# EAGLE schematic simple-loop-screws (EAGLE 6.6.0)

## Sheet 1 of 2
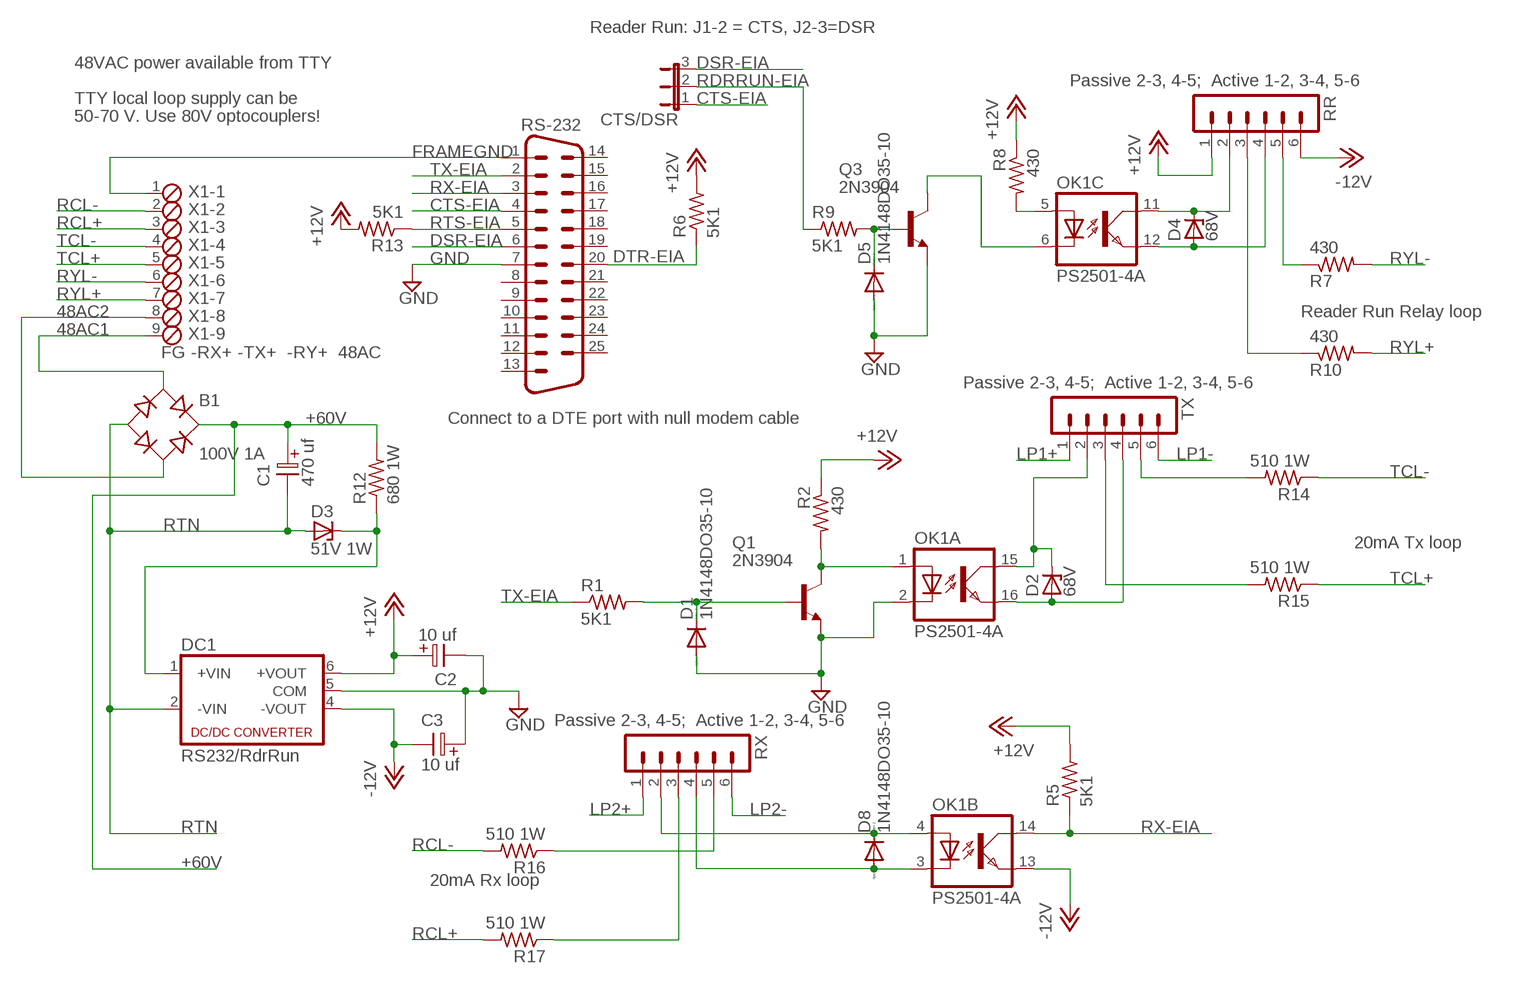
[diagram p0: schematic, sheet 1]

### Parts
B1  100V 1A  RB1A  [RB1A]
C1  470 uf  ELC-7,5  [ES-7,5]
C2  10 uf  ELC-2,5  [ES-2,5]
C3  10 uf  ELC-2,5  [ES-2,5]
CTS/DSR  JP2E  [JP2]
D1  1N4148DO35-10  [DO35-10]
D2  68V  ZENER-DIODEDO41Z10  [DO41Z10]
D3  51V 1W  ZENER-DIODEDO41Z10  [DO41Z10]
D4  68V  ZENER-DIODEDO41Z10  [DO41Z10]
D5  1N4148DO35-10  [DO35-10]
D8  1N4148DO35-10  [DO35-10]
DC1  RS232/RdrRun  NMA  [NMA]
OK1  PS2501-4A  ILQ1  [DIL16]
Q1  2N3904  [TO92]
Q3  2N3904  [TO92]
R1  5K1  R-US_0207/10  [0207/10]
R2  430  R-US_0207/10  [0207/10]
R5  5K1  R-US_0207/10  [0207/10]
R6  5K1  R-US_0207/10  [0207/10]
R7  430  R-US_0207/10  [0207/10]
R8  430  R-US_0207/10  [0207/10]
R9  5K1  R-US_0207/10  [0207/10]
R10  430  R-US_0207/10  [0207/10]
R12  680 1W  R-US_0817/7V  [P0817V]
R13  5K1  R-US_0207/10  [0207/10]
R14  510 1W  R-US_0817/7V  [P0817V]
R15  510 1W  R-US_0817/7V  [P0817V]
R16  510 1W  R-US_0817/7V  [P0817V]
R17  510 1W  R-US_0817/7V  [P0817V]
RR  MA06-1  [MA06-1]
RS-232  M25H  [M25H]
RX  MA06-1  [MA06-1]
TX  MA06-1  [MA06-1]
X1  FG -RX+ -TX+ -RY+ 48AC  MPT9  [9POL254]

### Nets
48AC1: B1.AC1 X1.9
48AC2: B1.AC2 X1.8
+12V: C2.1 DC1.6(+VOUT) R2.1 R5.2 R6.2 R8.1 R13.2 RR.1
+48VDC: D3.C DC1.1(+VIN) R12.1
+60V: B1.+ C1.1 R12.2 ; also sheet 2
-12V: C3.2 DC1.4(-VOUT) OK1.13(B:EMIT) RR.6
CTS-EIA: CTS/DSR.1 RS-232.4
DSR-EIA: CTS/DSR.3 RS-232.6
DTR-EIA: R6.1 RS-232.20
FRAMEGND: RS-232.1 X1.1
GND [GND]: C2.2 C3.1 D1.A D5.A DC1.5(COM) OK1.2(A:C) Q1.3(E) Q3.3(E) RS-232.7
LP1+: TX.1 ; also sheet 2
LP1-: TX.6 ; also sheet 2
LP2+: RX.1 ; also sheet 2
LP2-: RX.6 ; also sheet 2
N$1: D8.C OK1.4(B:A) RX.2
N$2: R16.1 RX.5
N$3: D8.A OK1.3(B:C) RX.4
N$4: D2.A OK1.16(A:EMIT) TX.4
N$5: OK1.5(C:A) R8.2
N$6: D2.C OK1.15(A:COL) TX.2
N$7: D1.C Q1.2(B) R1.2
N$8: D4.C OK1.11(C:COL) RR.2
N$9: OK1.1(A:A) Q1.1(C) R2.2
N$10: R10.1 RR.3
N$11: R7.1 RR.5
N$15: OK1.6(C:C) Q3.1(C)
N$16: D5.C Q3.2(B) R9.2
N$19: R14.2 TX.5
N$20: R17.1 RX.3
N$21: R15.2 TX.3
N$22: D4.A OK1.12(C:EMIT) RR.4
RCL+: R17.2 X1.3
RCL-: R16.2 X1.2
RDRRUN-EIA: CTS/DSR.2 R9.1
RTN: B1.- C1.2 D3.A DC1.2(-VIN) ; also sheet 2
RTS-EIA: R13.1 RS-232.5
RX-EIA: OK1.14(B:COL) R5.1 RS-232.3
RYL+: R10.2 X1.7
RYL-: R7.2 X1.6
TCL+: R15.1 X1.5
TCL-: R14.1 X1.4
TX-EIA: R1.1 RS-232.2
Unconnected: RS-232.8 RS-232.9 RS-232.10 RS-232.11 RS-232.12 RS-232.13 RS-232.14 RS-232.15 RS-232.16 RS-232.17 RS-232.18 RS-232.19 RS-232.21 RS-232.22 RS-232.23 RS-232.24 RS-232.25

### Notes on the sheet
- Reader Run: J1-2 = CTS, J2-3=DSR
- 48VAC power available from TTY
- Passive 2-3, 4-5;  Active 1-2, 3-4, 5-6
- TTY local loop supply can be
- 50-70 V. Use 80V optocouplers!
- Reader Run Relay loop
- Passive 2-3, 4-5;  Active 1-2, 3-4, 5-6
- Connect to a DTE port with null modem cable
- 20mA Tx loop
- Passive 2-3, 4-5;  Active 1-2, 3-4, 5-6
- 20mA Rx loop

## Sheet 2 of 2
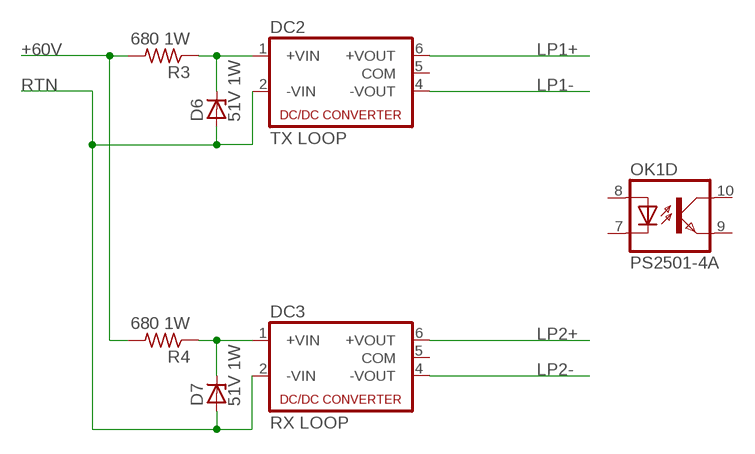
[diagram p1: schematic, sheet 2]

### Parts
D6  51V 1W  ZENER-DIODEDO41Z10  [DO41Z10]
D7  51V 1W  ZENER-DIODEDO41Z10  [DO41Z10]
DC2  TX LOOP  NMA  [NMA]
DC3  RX LOOP  NMA  [NMA]
R3  680 1W  R-US_0817/7V  [P0817V]
R4  680 1W  R-US_0817/7V  [P0817V]

### Nets
+48VDC1: D6.C DC2.1(+VIN) R3.1
+48VDC2: D7.C DC3.1(+VIN) R4.1
+60V: R3.2 R4.2 ; also sheet 1
LP1+: DC2.6(+VOUT) ; also sheet 1
LP1-: DC2.4(-VOUT) ; also sheet 1
LP2+: DC3.6(+VOUT) ; also sheet 1
LP2-: DC3.4(-VOUT) ; also sheet 1
RTN: D6.A D7.A DC2.2(-VIN) DC3.2(-VIN) ; also sheet 1
Unconnected: DC2.5(COM) DC3.5(COM) OK1.7(D:C) OK1.8(D:A) OK1.9(D:EMIT) OK1.10(D:COL)

## Library data of the parts
B1 = rectifier:RB1A: RECTIFIER 1 A
C1 = discrete:ELC-7,5
C2 C3 = discrete:ELC-2,5
CTS/DSR = jumper:JP2E: JUMPER
D1 D5 D8 = diode:1N4148: DIODE high speed (Philips)
D2-D4 D6 D7 = diode:ZENER-DIODE: Z-Diode
DC1-DC3 = dc-dc-converter:NMA: DC-DC CONVERTER; MF: C & D TECHNOLOGIES, INC; MPN: NMA0515SC; OC_FARNELL: 1021434; OC_NEWARK: 61K3064
OK1 = optocoupler:ILQ1: SIEMENS OPTO COUPLER; MF: VISHAY/TELEFUNKEN; MPN: ILQ1; OC_FARNELL: 1469501; OC_NEWARK: 88K1954
Q1 Q3 = transistor-npn:2N3904: NPN Transistor
R1-R10 R12-R17 = rcl:R-US_: RESISTOR, American symbol
RR RX TX = con-lstb:MA06-1: PIN HEADER; OC_FARNELL: unknown; OC_NEWARK: unknown
RS-232 = con-subd:M25: SUB-D; OC_FARNELL: unknown; OC_NEWARK: unknown
X1 = con-phoenix-254:MPT9: PHOENIX CONNECTOR; OC_FARNELL: unknown; OC_NEWARK: unknown

## Net classes
1 GND: width 0.508 mm